# EasyEDA schematic SCH_h_ty_2025829基于stm32单片机的智能药箱系统的设计与实现_2025-11-28.json
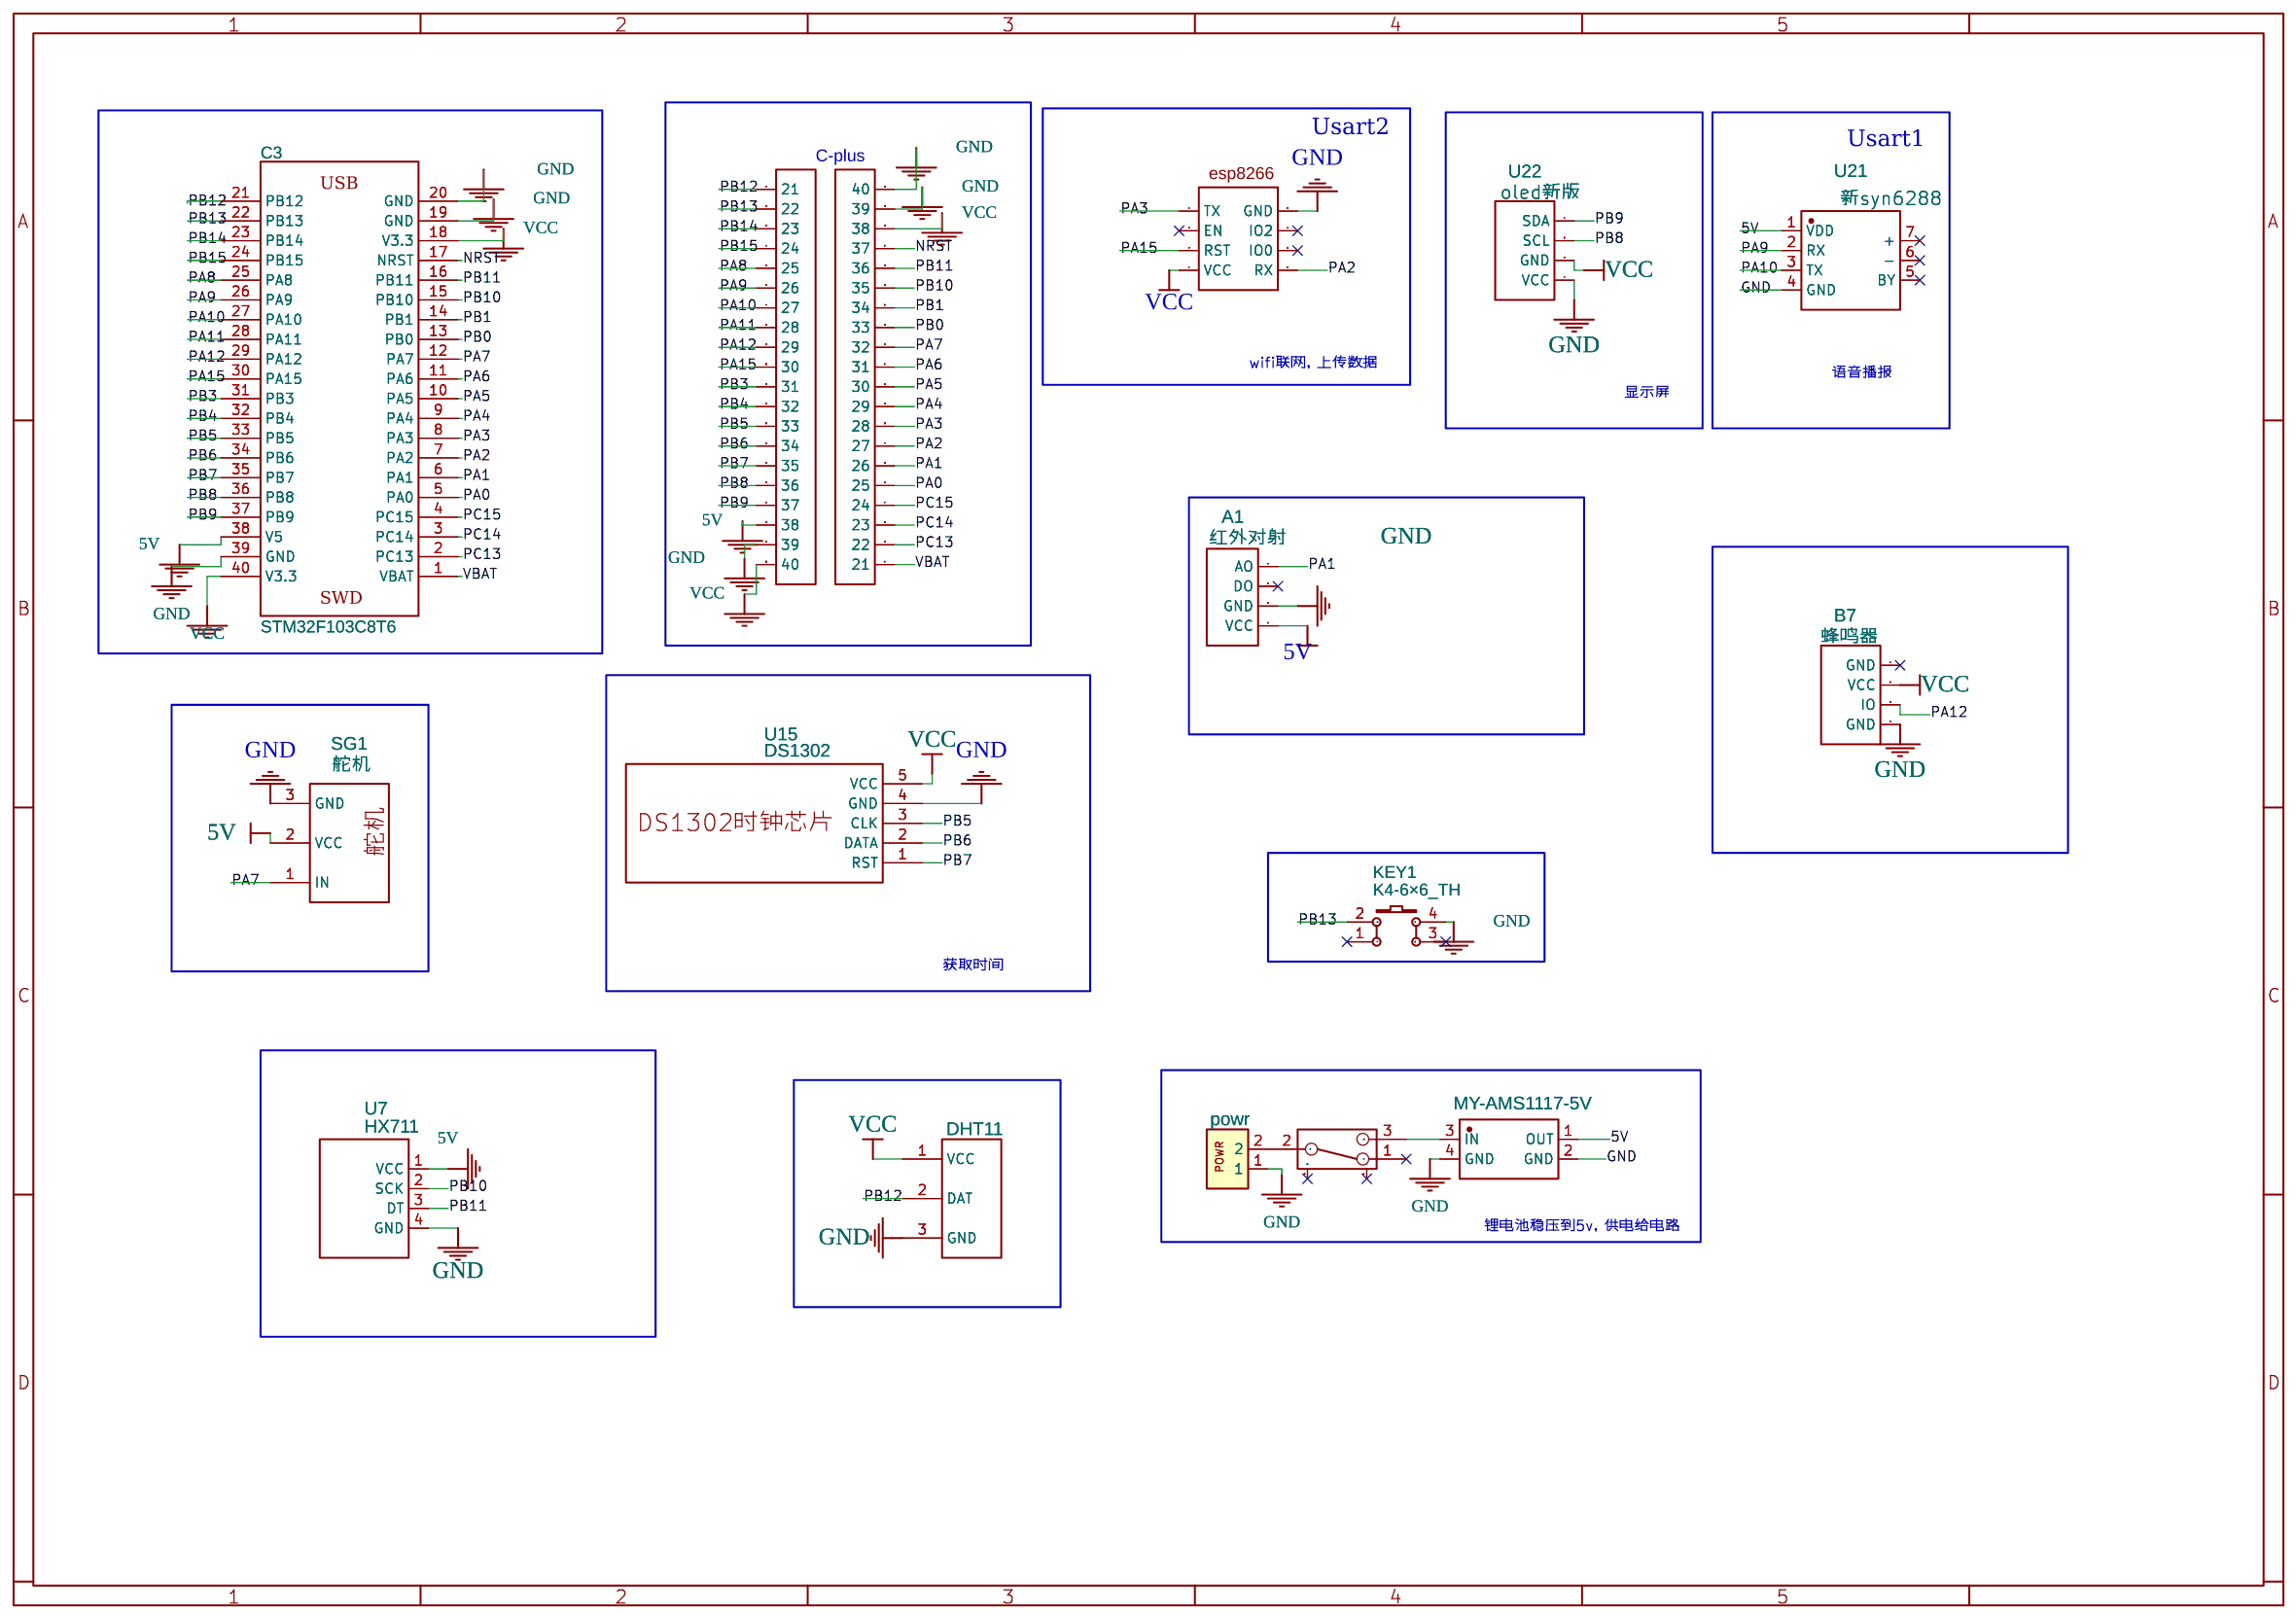
[diagram p0: schematic sheet]

## Parts
A1  红外对射  [ADC]
B7  蜂鸣器  [通用3.3]
C3  STM32F103C8T6  [STM32F103C8T6核心板]
DHT11  DHT11模块  [DHT11模块]
H2  HDR-F-2.54_1x20  [HDR-F-2.54_1X20]
H3  HDR-F-2.54_1x20  [HDR-F-2.54_1X20]
KEY1  K4-6×6_TH  [KEY-TH_4P-L6.0-W6.0-P4.50-LS6.5]
SG1  舵机  [SG90]
SW2  SK-12E12-G5  [SW-TH_SK-12E12-G5]
U2  powr  [POWR]
U7  HX711  [HX711]
U9  esp8266  [ESP826601S]
U12  MY-AMS1117-5V  [AMS1117]
U15  DS1302  [DS1302]
U21  新syn6288  [新SYN6288]
U22  oled新版  [0.96OLED新]

## Library data of the parts
A1 = ADC4P: Contributor: huangliangmeng
B7 = 通用3.3: Contributor: huangliangmeng
C3 = STM32F103C8T6最小系统模块: Convert to PCB: yes; Add into BOM: yes; Origin Footprint: STM32F103C8T6最小系统插座; Contributor: FlyingWings
DHT11 = DHT11模块: Contributor: huangliangmeng; Package Display: No
H2 H3 = HDR-F-2.54_1x20: Supplier Part: C50984; Supplier: LCSC; Convert to PCB: yes; Add into BOM: yes; Contributor: LCEDA_Lib
KEY1 = K4-6×6_TH: Supplier: LCSC; Supplier Part: C136684; Manufacturer: 韩国韩荣; Manufacturer Part: K2-1102DP-E4SW-04; Convert to PCB: yes; Add into BOM: yes; Contributor: LCEDA_Lib
SG1 = 舵机: Contributor: huangliangmeng
SW2 = SK-12E12-G5: Supplier: LCSC; Supplier Part: C136720; Manufacturer: Rectangular Connectors - Contacts; Convert to PCB: yes; Add into BOM: yes; Contributor: LCSC
U2 = powr: Contributor: huangliangmeng
U7 = HX711: Contributor: huangliangmeng
U9 = esp8266: Contributor: huangliangmeng
U12 = MY-AMS1117-5V: Contributor: huangliangmeng; Package Display: No
U15 = DS1302: Contributor: huangliangmeng
U21 = 新syn6288: Contributor: huangliangmeng
U22 = HDR-M-2.54_1x4: Supplier Part: C124378; Supplier: LCSC; Convert to PCB: yes; Add into BOM: yes; Origin Footprint: 0.96OLED_4P; Contributor: huangliangmeng

## Nets
5V: A1.1(VCC) C3.38(V5) H2.18(38) SG1.2(VCC) U7.1(VCC) U12.1(OUT) U21.1(VDD)
GND: A1.2(GND) B7.1(GND) C3.19(GND) C3.20(GND) C3.39(GND) DHT11.3(GND) H2.19(39) H3.19(39) H3.20(40) KEY1.4 SG1.3(GND) U2.1 U7.4(GND) U9.2(GND) U12.2(GND) U12.4(GND) U15.4(GND) U21.4(GND) U22.1(VCC)
VBAT: C3.1(VBAT) H3.1(21)
VCC: B7.3(VCC) C3.18(V3.3) C3.40(V3.3) DHT11.1(VCC) H2.20(40) H3.18(38) U9.7(VCC) U15.5(VCC) U22.2(GND)
NRST: C3.17(NRST) H3.17(37)
PA0: C3.5(PA0) H3.5(25)
PA1: A1.4(AO) C3.6(PA1) H3.6(26)
PA2: C3.7(PA2) H3.7(27) U9.8(RX)
PA3: C3.8(PA3) H3.8(28) U9.1(TX)
PA4: C3.9(PA4) H3.9(29)
PA5: C3.10(PA5) H3.10(30)
PA6: C3.11(PA6) H3.11(31)
PA7: C3.12(PA7) H3.12(32) SG1.1(IN)
PA8: C3.25(PA8) H2.5(25)
PA9: C3.26(PA9) H2.6(26) U21.2(RX)
PA10: C3.27(PA10) H2.7(27) U21.3(TX)
PA11: C3.28(PA11) H2.8(28)
PA12: B7.2(IO) C3.29(PA12) H2.9(29)
PA15: C3.30(PA15) H2.10(30) U9.5(RST)
PB0: C3.13(PB0) H3.13(33)
PB1: C3.14(PB1) H3.14(34)
PB3: C3.31(PB3) H2.11(31)
PB4: C3.32(PB4) H2.12(32)
PB5: C3.33(PB5) H2.13(33) U15.3(CLK)
PB6: C3.34(PB6) H2.14(34) U15.2(DATA)
PB7: C3.35(PB7) H2.15(35) U15.1(RST)
PB8: C3.36(PB8) H2.16(36) U22.3(SCL)
PB9: C3.37(PB9) H2.17(37) U22.4(SDA)
PB10: C3.15(PB10) H3.15(35) U7.2(SCK)
PB11: C3.16(PB11) H3.16(36) U7.3(DT)
PB12: C3.21(PB12) DHT11.2(DAT) H2.1(21)
PB13: C3.22(PB13) H2.2(22) KEY1.2
PB14: C3.23(PB14) H2.3(23)
PB15: C3.24(PB15) H2.4(24)
PC13: C3.2(PC13) H3.2(22)
PC14: C3.3(PC14) H3.3(23)
PC15: C3.4(PC15) H3.4(24)
Net-(SW2-2): SW2.2 U2.2
Net-(SW2-3): SW2.3 U12.3(IN)

Not connected (* = marked no-connect by the designer): A1 3(DO)*; B7 4(GND)*; KEY1 1* 3*; SW2 1* 4* 5*; U9 3(EN)* 4(IO2)* 6(IO0)*; U21 5(BY)* 6(-)* 7(+)*

## Notes on the sheet
- Usart2
- Usart1
- C-plus
- wifi联网，上传数据
- 语音播报
- 显示屏
- 获取时间
- 锂电池稳压到5v，供电给电路
